# Altium schematic sheet L298N Motor Driver Module Schematic.SchDoc
size A4; SheetNumber: 1; SheetTotal: 3
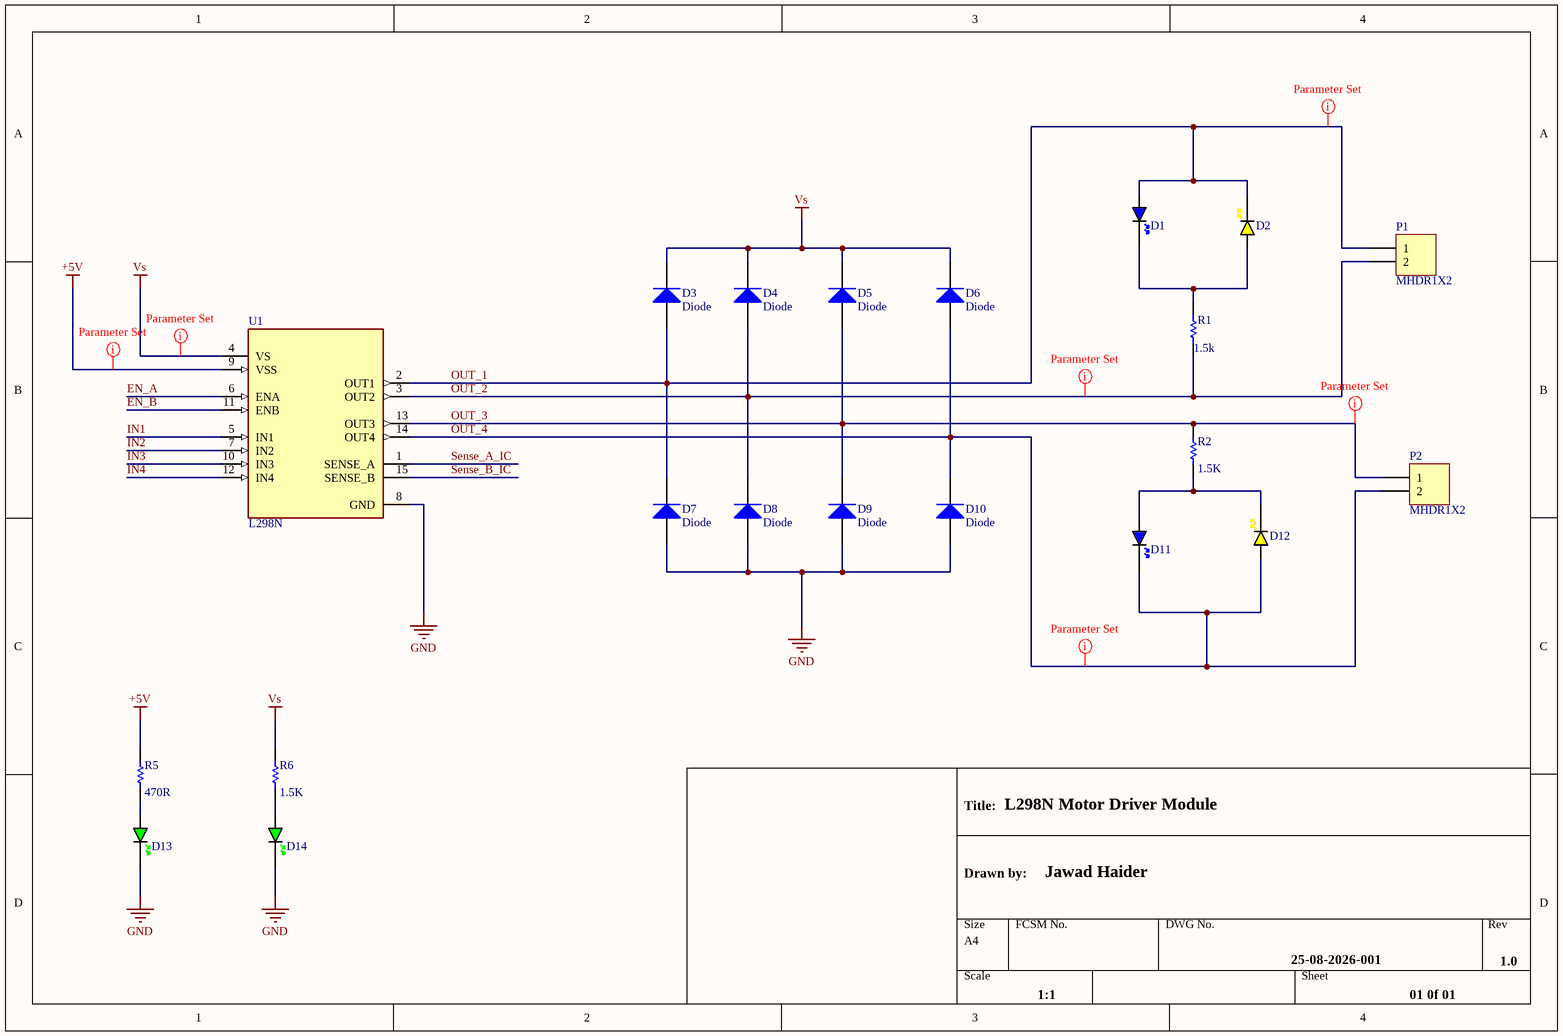
[diagram p0: L298N Motor Driver Module Schematic.SchDoc]

## Parts
D1  BLUE  [LED_0603_BLUE]  (value not drawn)
D2  YELLOW  [LED_0603_YELLOW]  (value not drawn)
D3  Diode  [Diode_M7_SMA]
D4  Diode  [Diode_M7_SMA]
D5  Diode  [Diode_M7_SMA]
D6  Diode  [Diode_M7_SMA]
D7  Diode  [Diode_M7_SMA]
D8  Diode  [Diode_M7_SMA]
D9  Diode  [Diode_M7_SMA]
D10  Diode  [Diode_M7_SMA]
D11  BLUE  [LED_0603_BLUE]  (value not drawn)
D12  YELLOW  [LED_0603_YELLOW]  (value not drawn)
D13  GREEN  [LED_0603_GREEN]  (value not drawn)
D14  GREEN  [LED_0603_GREEN]  (value not drawn)
P1  MHDR1X2  [Terminal block 2 pin 5.08mm]
P2  MHDR1X2  [Terminal block 2 pin 5.08mm]
R1  value 1.5k  [RES_0603]  (hidden comment: Res1)
R2  value 1.5K  [RES_0603]  (hidden comment: Res1)
R5  value 470R  [RES_0603]  (hidden comment: Res1)
R6  value 1.5K  [RES_0603]  (hidden comment: Res1)
U1  L298N  [TO127P2020X500X2100-15]

## Nets
+5V: R5.2 U1.9(VSS)
GND: D7.1(A) D8.1(A) D9.1(A) D10.1(A) D13.K D14.K U1.8(GND)
Vs: D3.2(K) D4.2(K) D5.2(K) D6.2(K) R6.2 U1.4(VS)
EN_A: U1.6(ENA)
EN_B: U1.11(ENB)
IN1: U1.5(IN1)
IN2: U1.7(IN2)
IN3: U1.10(IN3)
IN4: U1.12(IN4)
OUT_1: D1.A D2.K D3.1(A) D7.2(K) P1.1 U1.2(OUT1)
OUT_2: D4.1(A) D8.2(K) P1.2 R1.1 U1.3(OUT2)
OUT_3: D5.1(A) D9.2(K) P2.1 R2.2 U1.13(OUT3)
OUT_4: D6.1(A) D10.2(K) D11.K D12.A P2.2 U1.14(OUT4)
Sense_A_IC: U1.1(SENSE_A)
Sense_B_IC: U1.15(SENSE_B)
NetD1_K: D1.K D2.A R1.2
NetD11_A: D11.A D12.K R2.1
NetD13_A: D13.A R5.1
NetD14_A: D14.A R6.1

## Layout directives
net class Power: OUT_1, OUT_2, OUT_3, OUT_4, Vs
net class +5V Rail: +5V

## Notes on the sheet
- Title:
- L298N Motor Driver Module
- Drawn by:
- Jawad Haider
- 25-08-2026-001
- 1.0
- 1:1
- 01 0f 01
- Size:
- Date:
- Title
- A4
- Number:
- Time:
- Revision:
- Sheet
- of
- Engineer
- File:

## Library data of the parts
D1 D11 = LED_0603_BLUE: LED 0603 BLUE SMD
D2 D12 = LED_0603_YELLOW: LED 0603 YELLOW SMD
D3-D10 = Diode: Default Diode; Published: 8-Jun-2000; LatestRevisionDate: 17-Jul-2002; LatestRevisionNote: Re-released for DXP Platform.; PackageVersion: Sep-1996; PackageReference: SMC; Publisher: Altium Limited; PackageDescription: DO-214-AB/SMC; 2 C-Bend Leads; Body 7.9 x 5.9 mm, inc. leads (LxW); Code_JEDEC: DO-214-AB
D13 D14 = LED_0603_GREEN: LED 0603 GREEN SMD
P1 P2 = MHDR1X2: Header, 2-Pin; LatestRevisionDate: 17-Jul-2002; LatestRevisionNote: Re-released for DXP Platform.; Publisher: Altium Limited
R1 R2 R5 R6 = Res1: Resistor; Published: 8-Jun-2000; LatestRevisionDate: 17-Jul-2002; LatestRevisionNote: Re-released for DXP Platform.; PackageReference: AXIAL-0.3; Publisher: Altium Limited; PackageDescription: Axial Device, Thru-Hole; 2 Leads; 0.3 in Pin Spacing
U1 = L298N: Dual Full Bridge Motor Driver 15-Pin(15+Tab) MULTIWATT V Tube; MP: L298N; Availability: Unavailable; Package: None; Value: *; Price: None